# Altium schematic sheet Audio.SchDoc
size A4
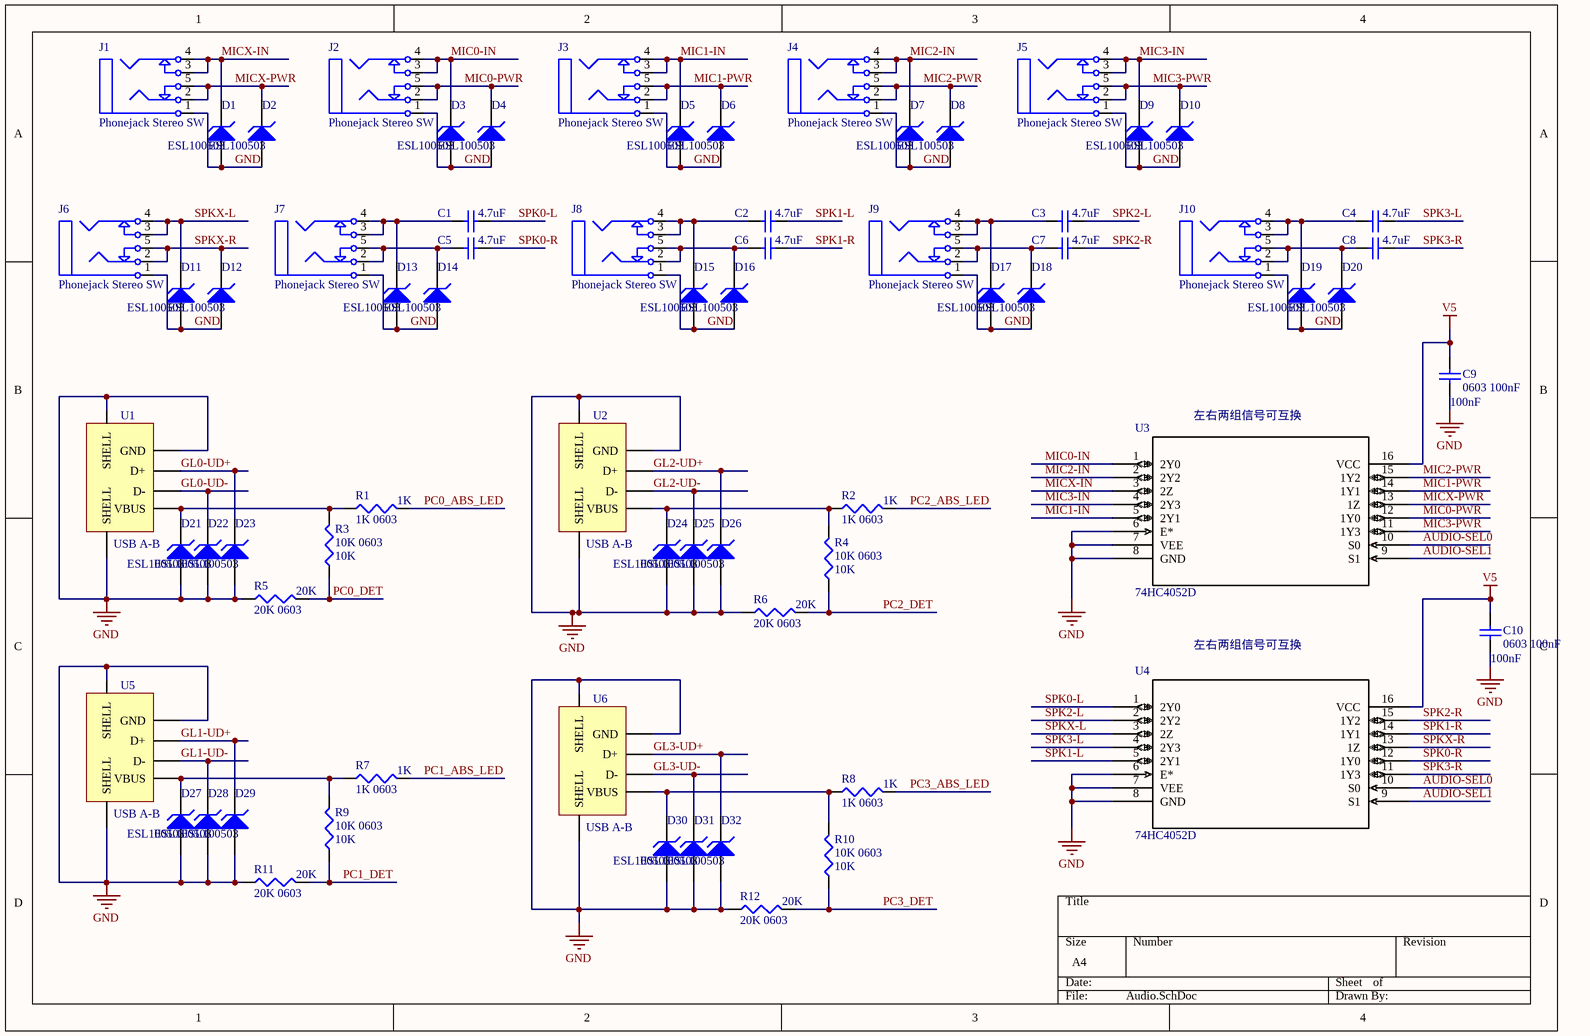
[diagram p0: Audio.SchDoc]

## Parts
C1  value 4.7uF  [C0603]  (hidden comment: 0603 4.7uF)
C2  value 4.7uF  [C0603]  (hidden comment: 0603 4.7uF)
C3  value 4.7uF  [C0603]  (hidden comment: 0603 4.7uF)
C4  value 4.7uF  [C0603]  (hidden comment: 0603 4.7uF)
C5  value 4.7uF  [C0603]  (hidden comment: 0603 4.7uF)
C6  value 4.7uF  [C0603]  (hidden comment: 0603 4.7uF)
C7  value 4.7uF  [C0603]  (hidden comment: 0603 4.7uF)
C8  value 4.7uF  [C0603]  (hidden comment: 0603 4.7uF)
C9  0603 100nF  value 100nF  [C0603]
C10  0603 100nF  value 100nF  [C0603]
D1  ESL100503  [C0402]
D2  ESL100503  [C0402]
D3  ESL100503  [C0402]
D4  ESL100503  [C0402]
D5  ESL100503  [C0402]
D6  ESL100503  [C0402]
D7  ESL100503  [C0402]
D8  ESL100503  [C0402]
D9  ESL100503  [C0402]
D10  ESL100503  [C0402]
D11  ESL100503  [C0402]
D12  ESL100503  [C0402]
D13  ESL100503  [C0402]
D14  ESL100503  [C0402]
D15  ESL100503  [C0402]
D16  ESL100503  [C0402]
D17  ESL100503  [C0402]
D18  ESL100503  [C0402]
D19  ESL100503  [C0402]
D20  ESL100503  [C0402]
D21  ESL100503  [C0402]
D22  ESL100503  [C0402]
D23  ESL100503  [C0402]
D24  ESL100503  [C0402]
D25  ESL100503  [C0402]
D26  ESL100503  [C0402]
D27  ESL100503  [C0402]
D28  ESL100503  [C0402]
D29  ESL100503  [C0402]
D30  ESL100503  [C0402]
D31  ESL100503  [C0402]
D32  ESL100503  [C0402]
J1  Phonejack Stereo SW  [ST-3150-5N]
J2  Phonejack Stereo SW  [ST-3150-5N]
J3  Phonejack Stereo SW  [ST-3150-5N]
J4  Phonejack Stereo SW  [ST-3150-5N]
J5  Phonejack Stereo SW  [ST-3150-5N]
J6  Phonejack Stereo SW  [ST-3150-5N]
J7  Phonejack Stereo SW  [ST-3150-5N]
J8  Phonejack Stereo SW  [ST-3150-5N]
J9  Phonejack Stereo SW  [ST-3150-5N]
J10  Phonejack Stereo SW  [ST-3150-5N]
R1  1K 0603  value 1K  [R0603]
R2  1K 0603  value 1K  [R0603]
R3  10K 0603  value 10K  [R0603]
R4  10K 0603  value 10K  [R0603]
R5  20K 0603  value 20K  [R0603]
R6  20K 0603  value 20K  [R0603]
R7  1K 0603  value 1K  [R0603]
R8  1K 0603  value 1K  [R0603]
R9  10K 0603  value 10K  [R0603]
R10  10K 0603  value 10K  [R0603]
R11  20K 0603  value 20K  [R0603]
R12  20K 0603  value 20K  [R0603]
U1  USB A-B  [USB-A]
U2  USB A-B  [USB-A]
U3  74HC4052D  [SOT109-1]
U4  74HC4052D  [SOT109-1]
U5  USB A-B  [USB-A]
U6  USB A-B  [USB-A]

## Nets
GND: C9.1 C10.1 D1.1(A) D2.1(A) D3.1(A) D4.1(A) D5.1(A) D6.1(A) D7.1(A) D8.1(A) D9.1(A) D10.1(A) D11.1(A) D12.1(A) D13.1(A) D14.1(A) D15.1(A) D16.1(A) D17.1(A) D18.1(A) D19.1(A) D20.1(A) D21.1(A) D22.1(A) D23.1(A) D24.1(A) D25.1(A) D26.1(A) D27.1(A) D28.1(A) D29.1(A) D30.1(A) D31.1(A) D32.1(A) J1.1 J2.1 J3.1 J4.1 J5.1 J6.1 J7.1 J8.1 J9.1 J10.1 R5.1 R6.1 R11.1 R12.1 U1.4(GND) U1.5(SHELL) U1.6(SHELL) U2.4(GND) U2.5(SHELL) U2.6(SHELL) U3.6(E*) U3.7(VEE) U3.8(GND) U4.6(E*) U4.7(VEE) U4.8(GND) U5.4(GND) U5.5(SHELL) U5.6(SHELL) U6.4(GND) U6.5(SHELL) U6.6(SHELL)
V5: C9.2 C10.2 U3.16(VCC) U4.16(VCC)
AUDIO-SEL0: U3.10(S0) U4.10(S0)
AUDIO-SEL1: U3.9(S1) U4.9(S1)
GL0-UD+: D23.2(K) U1.3(D+)
GL0-UD-: D22.2(K) U1.2(D-)
GL1-UD+: D29.2(K) U5.3(D+)
GL1-UD-: D28.2(K) U5.2(D-)
GL2-UD+: D26.2(K) U2.3(D+)
GL2-UD-: D25.2(K) U2.2(D-)
GL3-UD+: D32.2(K) U6.3(D+)
GL3-UD-: D31.2(K) U6.2(D-)
MIC0-IN: D3.2(K) J2.3 J2.4 U3.1(2Y0)
MIC0-PWR: D4.2(K) J2.2 J2.5 U3.12(1Y0)
MIC1-IN: D5.2(K) J3.3 J3.4 U3.5(2Y1)
MIC1-PWR: D6.2(K) J3.2 J3.5 U3.14(1Y1)
MIC2-IN: D7.2(K) J4.3 J4.4 U3.2(2Y2)
MIC2-PWR: D8.2(K) J4.2 J4.5 U3.15(1Y2)
MIC3-IN: D9.2(K) J5.3 J5.4 U3.4(2Y3)
MIC3-PWR: D10.2(K) J5.2 J5.5 U3.11(1Y3)
MICX-IN: D1.2(K) J1.3 J1.4 U3.3(2Z)
MICX-PWR: D2.2(K) J1.2 J1.5 U3.13(1Z)
PC0_ABS_LED: R1.2
PC0_DET: R3.1 R5.2
PC1_ABS_LED: R7.2
PC1_DET: R9.1 R11.2
PC2_ABS_LED: R2.2
PC2_DET: R4.1 R6.2
PC3_ABS_LED: R8.2
PC3_DET: R10.1 R12.2
SPK0-L: C1.1 U4.1(2Y0)
SPK0-R: C5.1 U4.12(1Y0)
SPK1-L: C2.1 U4.5(2Y1)
SPK1-R: C6.1 U4.14(1Y1)
SPK2-L: C3.1 U4.2(2Y2)
SPK2-R: C7.1 U4.15(1Y2)
SPK3-L: C4.1 U4.4(2Y3)
SPK3-R: C8.1 U4.11(1Y3)
SPKX-L: D11.2(K) J6.3 J6.4 U4.3(2Z)
SPKX-R: D12.2(K) J6.2 J6.5 U4.13(1Z)
NetC1_2: C1.2 D13.2(K) J7.3 J7.4
NetC2_2: C2.2 D15.2(K) J8.3 J8.4
NetC3_2: C3.2 D17.2(K) J9.3 J9.4
NetC4_2: C4.2 D19.2(K) J10.3 J10.4
NetC5_2: C5.2 D14.2(K) J7.2 J7.5
NetC6_2: C6.2 D16.2(K) J8.2 J8.5
NetC7_2: C7.2 D18.2(K) J9.2 J9.5
NetC8_2: C8.2 D20.2(K) J10.2 J10.5
NetD21_2: D21.2(K) R1.1 R3.2 U1.1(VBUS)
NetD24_2: D24.2(K) R2.1 R4.2 U2.1(VBUS)
NetD27_2: D27.2(K) R7.1 R9.2 U5.1(VBUS)
NetD30_2: D30.2(K) R8.1 R10.2 U6.1(VBUS)

## Notes on the sheet
- (near U3) 左右两组信号可互换
- 左右两组信号可互换

## Library data of the parts
C1-C10 = Cap Semi: Capacitor (Semiconductor SIM Model); Published: 8-Jun-2000; LatestRevisionDate: 29-May-2009; LatestRevisionNote: IPC-7351 Footprint Added.; PackageReference: C1206; Publisher: Altium Limited; PackageDescription: Chip Capacitor
D1-D32 = D Zener: Published: 8-Jun-2000; LatestRevisionDate: 17-Jul-2002; LatestRevisionNote: Re-released for DXP Platform.; Publisher: Altium Limited; PackageDescription: Diode, Thru-Hole; 2 Leads; 0.7 in Pin Spacing
  D1-D25 D27-D32: PackageReference: DIODE-0.7
  D26: PackageReference: 0402
J1-J10 = Phonejack Stereo SW: 3-Conductor Jack with 2 break contacts (normals) and 2 auxiliary make contacts; Published: 5-Jan-2004; LatestRevisionDate: 17-Dec-2003; LatestRevisionNote: PCB Footprint replaced.; DatasheetDocument: 07-Mar-2000; Publisher: Altium Limited; ComponentLink1Description: Manufacturer Link; ComponentLink1URL: http://domino.kycon.com/internet/Products.html
R1-R12 = Res3: Resistor; Published: 8-Jun-2000; LatestRevisionDate: 29-May-2009; LatestRevisionNote: IPC-7351 Footprint Added.; PackageReference: J1-0603; Publisher: Altium Limited; PackageDescription: Chip Resistor
U3 U4 = 74HC4052D: Imported; Vendor: NXP; Built_By: EMA_UL_Team; C: Copyright (C) 2015 Accelerated Designs. All rights reserved; Manufacturer_Part_Number: 74hc4052d; RefDes: RefDes; Type: Type; Value: Value